# Altium schematic sheet LSW_0_HCMS29_STM32L0.SchDoc
size A4
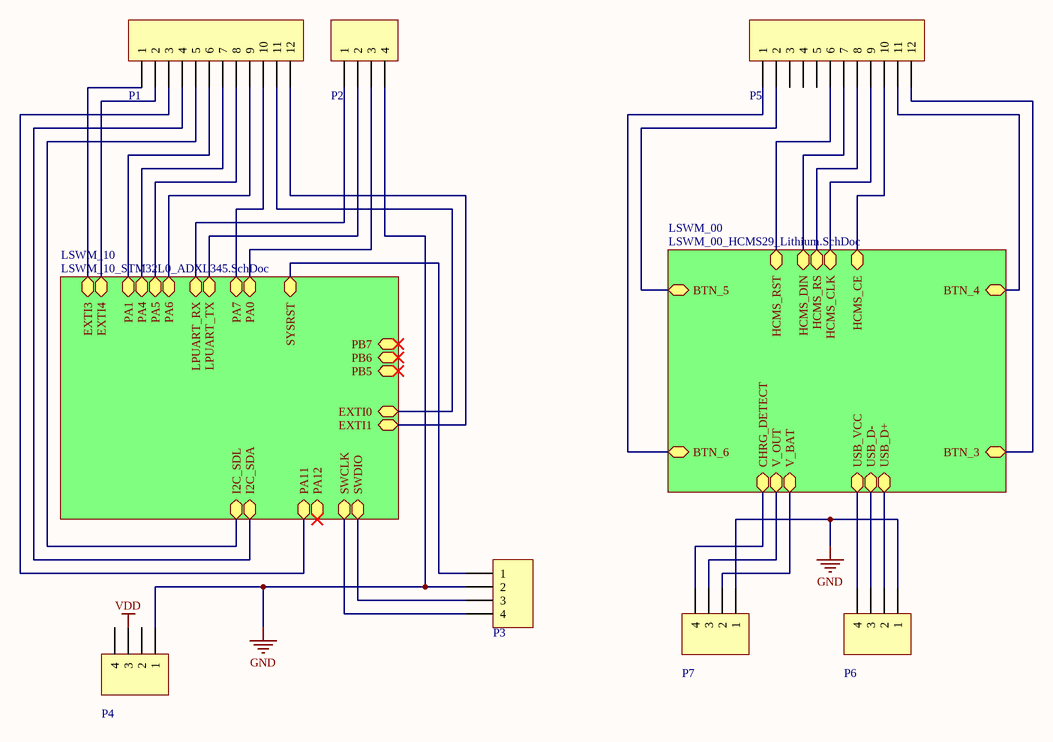
[diagram p0: LSW_0_HCMS29_STM32L0.SchDoc]

## Parts
P1  Header 12  [HDR12X1_1.27mm]  (value not drawn)
P2  Header 4  [HDR4X1_1.27mm]  (value not drawn)
P3  Header 4  [HDR4X1_1.27mm]  (value not drawn)
P4  Header 4  [HDR4X1_1.27mm]  (value not drawn)
P5  Header 12  [HDR12X1_1.27mm]  (value not drawn)
P6  Header 4  [HDR4X1_1.27mm]  (value not drawn)
P7  Header 4  [HDR4X1_1.27mm]  (value not drawn)

## Sub-sheets
LSWM_00 = LSWM_00_HCMS29_Lithium.SchDoc: HCMS_RST, HCMS_DIN, HCMS_RS, HCMS_CLK, HCMS_CE, BTN_3, BTN_4, BTN_5, BTN_6, V_BAT, V_OUT, CHRG_DETECT, USB_VCC, USB_D+, USB_D-
LSWM_10 = LSWM_10_STM32L0_ADXL345.SchDoc: EXTI0, EXTI1, EXTI3, EXTI4, PA7, PA6, PA5, PA4, LPUART_RX, LPUART_TX, SYSRST, SWDIO, SWCLK, PA12, PA11, I2C_SDA, I2C_SDL, PB5, PB6, PB7, PA0, PA1

## Nets
GND: P2.4 P3.2 P4.1 P6.1 P7.1
VDD: P4.3
NetP1_1: P1.1 ; sheet LSWM_10/EXTI3
NetP1_2: P1.2 ; sheet LSWM_10/EXTI4
NetP1_3: P1.3 ; sheet LSWM_10/PA11
NetP1_4: P1.4 ; sheet LSWM_10/I2C_SDA
NetP1_5: P1.5 ; sheet LSWM_10/I2C_SDL
NetP1_6: P1.6 ; sheet LSWM_10/PA1
NetP1_7: P1.7 ; sheet LSWM_10/PA4
NetP1_8: P1.8 ; sheet LSWM_10/PA5
NetP1_9: P1.9 ; sheet LSWM_10/PA6
NetP1_10: P1.10 ; sheet LSWM_10/PA7
NetP1_11: P1.11 ; sheet LSWM_10/EXTI0
NetP1_12: P1.12 ; sheet LSWM_10/EXTI1
NetP2_1: P2.1 ; sheet LSWM_10/LPUART_RX
NetP2_2: P2.2 ; sheet LSWM_10/LPUART_TX
NetP2_3: P2.3 ; sheet LSWM_10/PA0
NetP3_1: P3.1 ; sheet LSWM_10/SYSRST
NetP3_3: P3.3 ; sheet LSWM_10/SWDIO
NetP3_4: P3.4 ; sheet LSWM_10/SWCLK
NetP5_1: P5.1 ; sheet LSWM_00/BTN_6
NetP5_2: P5.2 ; sheet LSWM_00/BTN_5
NetP5_6: P5.6 ; sheet LSWM_00/HCMS_RST
NetP5_7: P5.7 ; sheet LSWM_00/HCMS_DIN
NetP5_8: P5.8 ; sheet LSWM_00/HCMS_RS
NetP5_9: P5.9 ; sheet LSWM_00/HCMS_CLK
NetP5_10: P5.10 ; sheet LSWM_00/HCMS_CE
NetP5_11: P5.11 ; sheet LSWM_00/BTN_4
NetP5_12: P5.12 ; sheet LSWM_00/BTN_3
NetP6_2: P6.2 ; sheet LSWM_00/USB_D+
NetP6_3: P6.3 ; sheet LSWM_00/USB_D-
NetP6_4: P6.4 ; sheet LSWM_00/USB_VCC
NetP7_2: P7.2 ; sheet LSWM_00/V_BAT
NetP7_3: P7.3 ; sheet LSWM_00/V_OUT
NetP7_4: P7.4 ; sheet LSWM_00/CHRG_DETECT

Not connected (* = marked no-connect by the designer): P4 2 4; P5 3 4 5

## Library data of the parts
P1 P5 = Header 12: 接插件; LatestRevisionDate: 17-Jul-2002; LatestRevisionNote: Re-released for DXP Platform.; Publisher: Altium Limited
P2-P4 P6 P7 = Header 4: 接插件; LatestRevisionDate: 17-Jul-2002; LatestRevisionNote: Re-released for DXP Platform.; Publisher: Altium Limited